# Altium schematic sheet RGB.SchDoc
size A4; Author: Wojciech Gredel; CompanyName: AGH UST; Revision: 1; ProjectName: My_project1
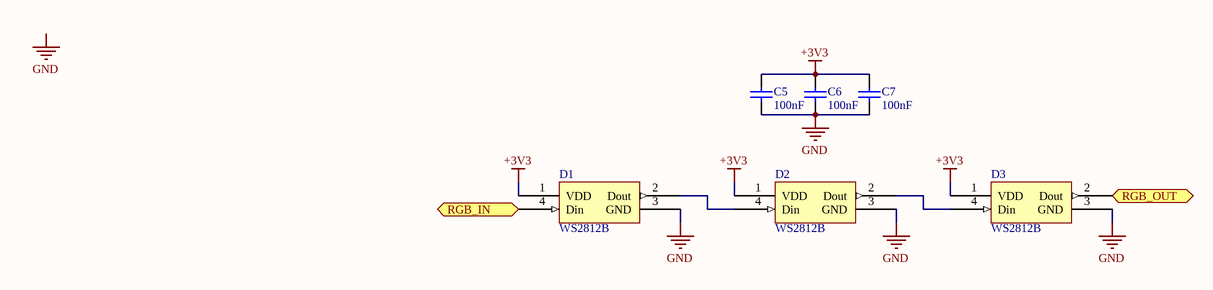
[diagram p0: RGB.SchDoc]

## Parts
C5  value 100nF  [CAP_0805_IPC_MD]  (hidden comment: Cap)
C6  value 100nF  [CAP_0805_IPC_MD]  (hidden comment: Cap)
C7  value 100nF  [CAP_0805_IPC_MD]  (hidden comment: Cap)
D1  RGB LED  [WS2812B]  (value not drawn)
D2  RGB LED  [WS2812B]  (value not drawn)
D3  RGB LED  [WS2812B]  (value not drawn)

## Ports
RGB_IN (in), RGB_OUT (out)

## Nets
+3V3: C5.2 C6.2 C7.2 D1.1(VDD) D2.1(VDD) D3.1(VDD)
GND: C5.1 C6.1 C7.1 D1.3(GND) D2.3(GND) D3.3(GND)
RGB_IN: D1.4(Din) ; port RGB_IN
RGB_OUT: D3.2(Dout) ; port RGB_OUT
NetD1_2: D1.2(Dout) D2.4(Din)
NetD2_2: D2.2(Dout) D3.4(Din)

## Notes on the sheet
- Labels drawn without touching a wire or pin: GND
- Confidential / Not for distribution !
- Project name:
- Document name:
- Designer Name:
- Date/Time:
- Revision:

## Library data of the parts
C5-C7 = Cap: Capacitor; Manufacturer: Samsung; Supplier Part Number: CL21B104KBCNNNC; Supplier: TME
D1-D3 = RGB LED: Programmable RGB LED; Manufacturer: Worldsemi; Supplier: TME; Supplier Part Number: WS2812B; Manufacturer Part Number: WS2812B